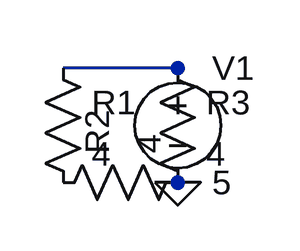
[diagram p0: schematic code.asc]
code.asc, the LTspice schematic file:
Version 4
SHEET 1 880 680
SYMBOL voltage 100 84 R0
SYMATTR InstName V1
SYMATTR Value 5
SYMBOL res 4 84 R0
SYMATTR InstName R1
SYMATTR Value 4
SYMBOL res 4 196 R270
SYMATTR InstName R2
SYMATTR Value 4
SYMBOL res 84 84 R0
SYMATTR InstName R3
SYMATTR Value 4
WIRE 100 100 20 100
FLAG 100 180 0

The netlist it stands for:
* code.asc
V1 N001 0 5
R1 N001 P001 4
R2 P001 0 4
R3 N001 0 4
.backanno
.end